# EasyEDA schematic Bras droit.json
TITLE: Arm Right; REV: 1.0; Date: 2020-07-07; Sheet: 1/1; Company: Your Company
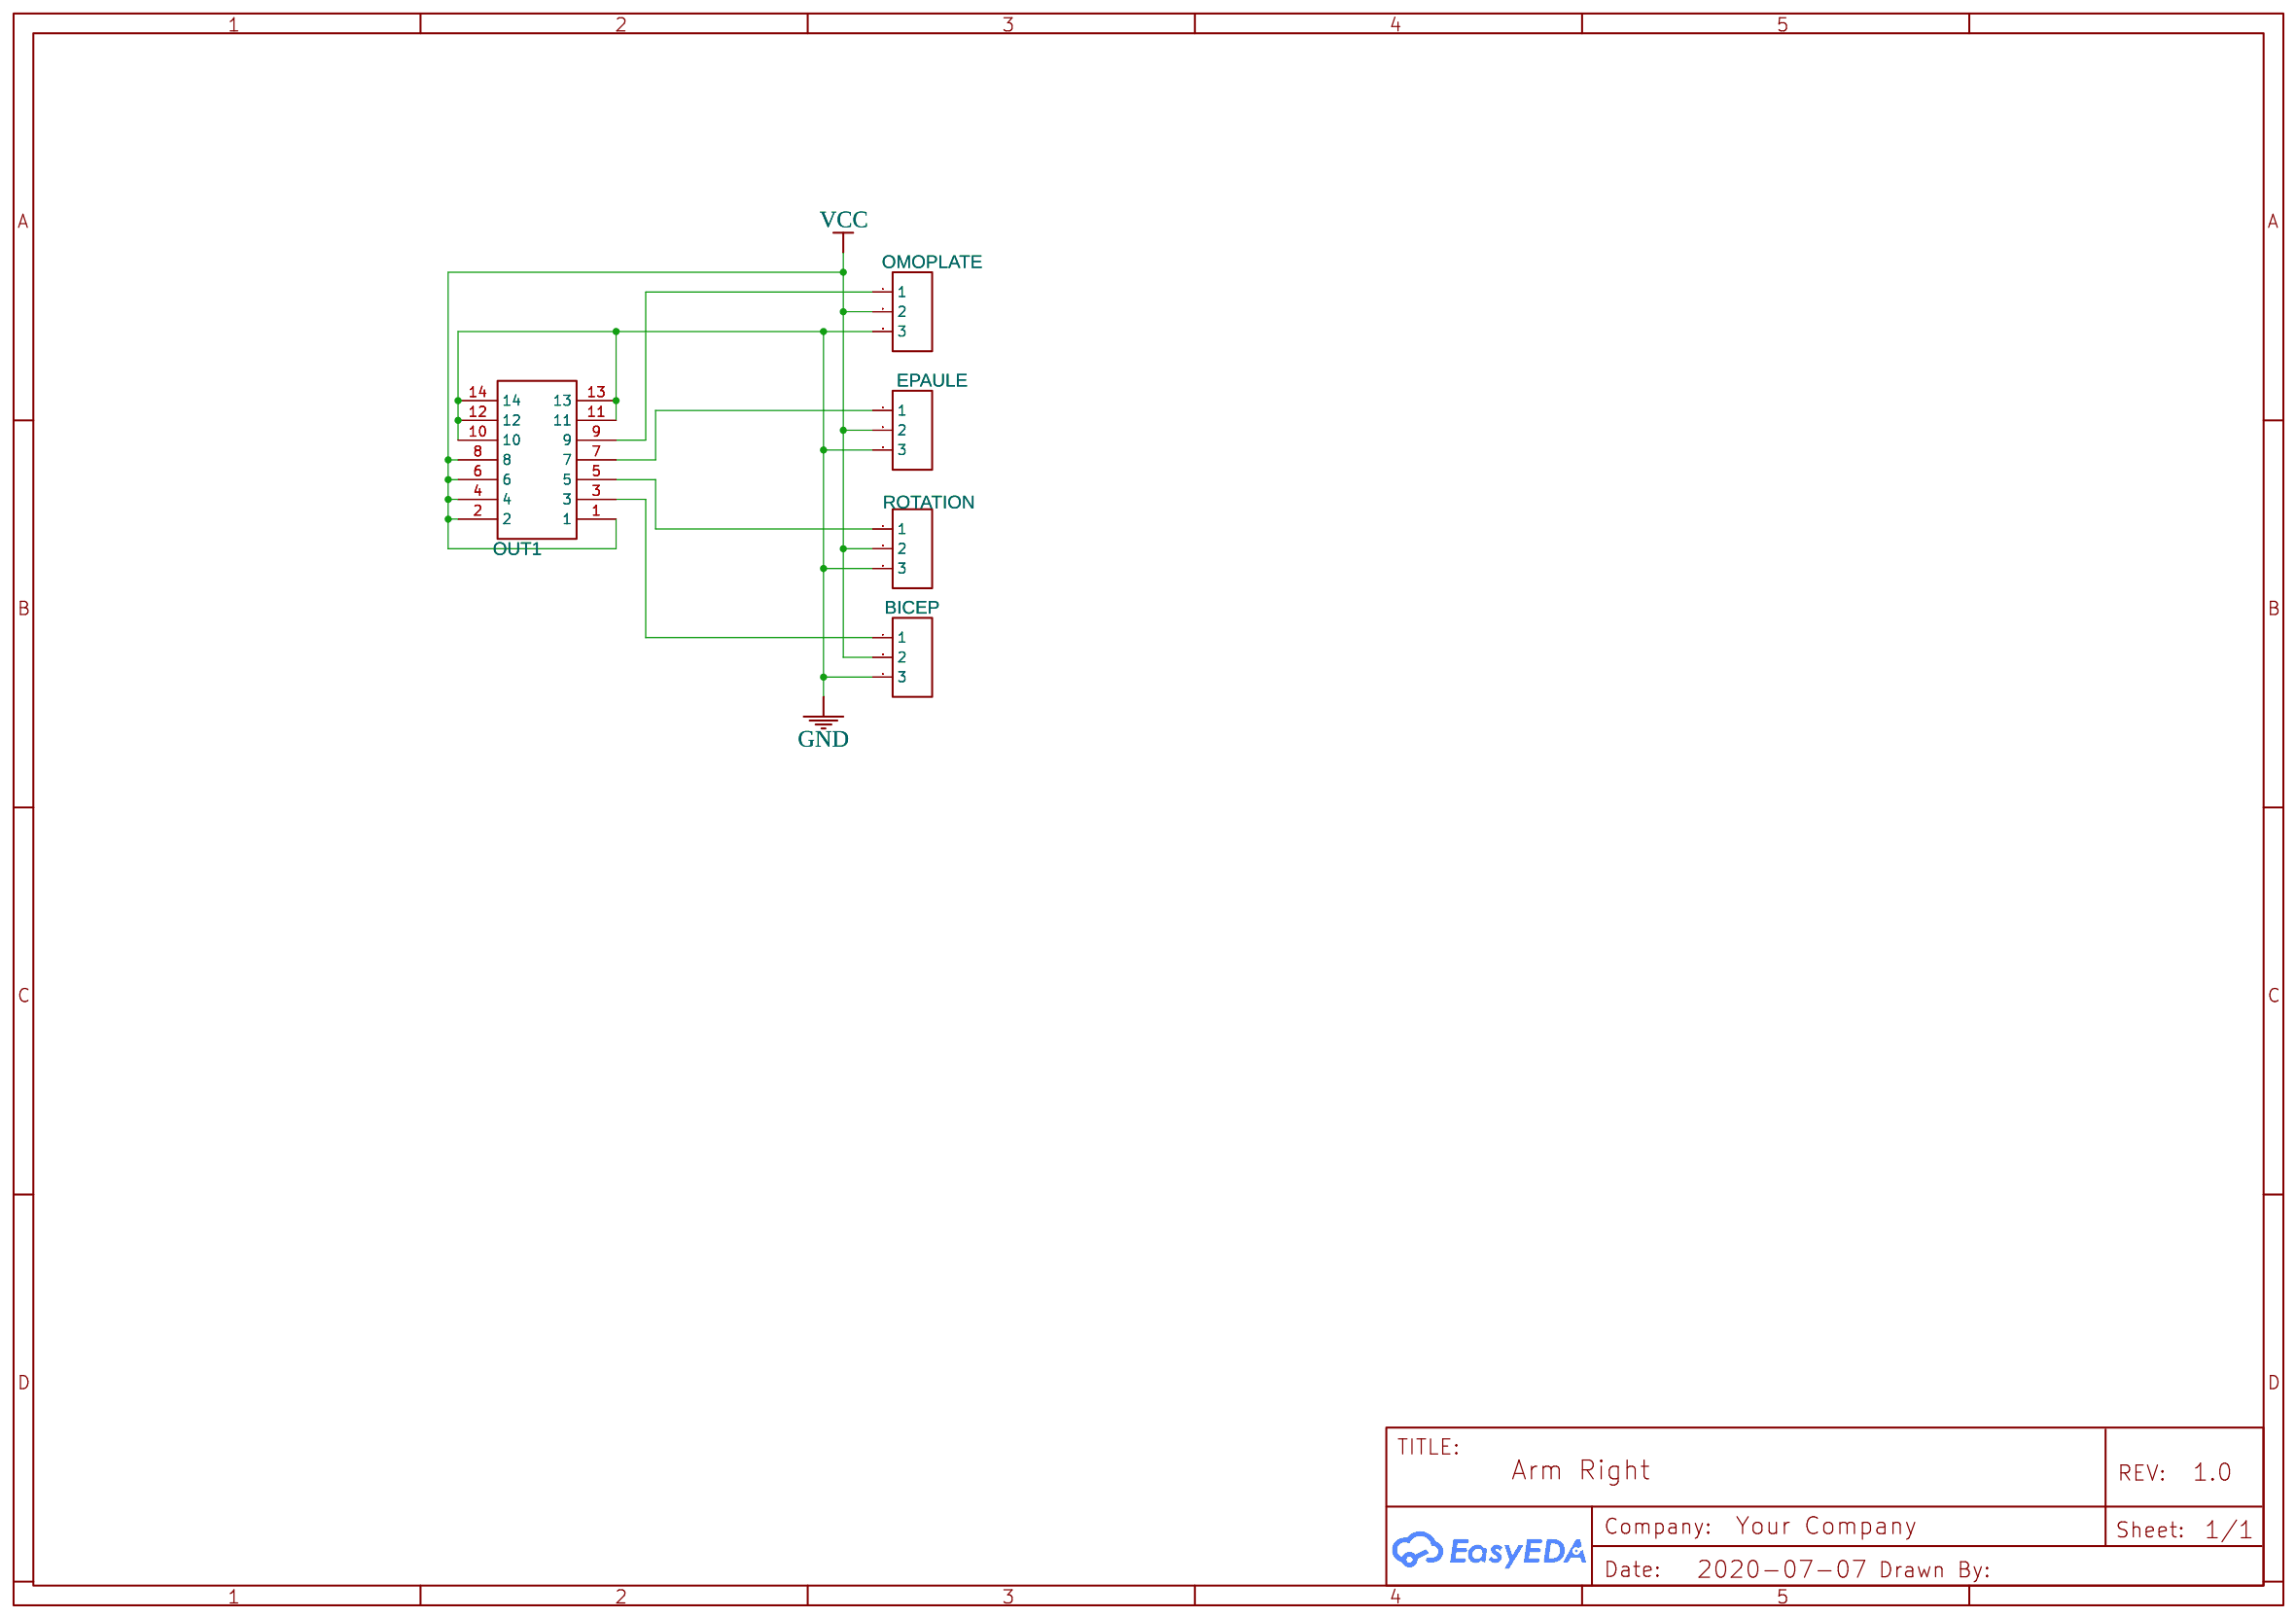
[diagram p0: schematic sheet]

## Parts
BICEP  1  [HDR-TH_3P-P2.54-V]
EPAULE  1  [HDR-TH_3P-P2.54-V]
OMOPLATE  1  [HDR-TH_3P-P2.54-V]
OUT1  Horn connector/2.0mm2*7P  [IDC-TH_14P-P2.00-V-M-R2-C7-S2.00]
ROTATION  1  [HDR-TH_3P-P2.54-V]

## Library data of the parts
BICEP EPAULE OMOPLATE ROTATION = Header-Male-2.54_1x3: Supplier: LCSC; Manufacturer: BOOMELE; Manufacturer Part: Header2.54mm 1*3P; image: //image.lceda.cn/szlcsc/C49257.jpg; Supplier Part: C49257
OUT1 = Horn connector/2.0mm2*7P: Supplier: LCSC; Manufacturer: BOOMELE; Manufacturer Part: Horn connector/2.0mm2*7P直简牛; Supplier Part: C29428

## Nets
GND: BICEP.3 EPAULE.3 OMOPLATE.3 OUT1.10 OUT1.11 OUT1.12 OUT1.13 OUT1.14 ROTATION.3
VCC: BICEP.2 EPAULE.2 OMOPLATE.2 OUT1.1 OUT1.2 OUT1.4 OUT1.6 OUT1.8 ROTATION.2
Net-(BICEP-1): BICEP.1 OUT1.3
Net-(EPAULE-1): EPAULE.1 OUT1.7
Net-(OMOPLATE-1): OMOPLATE.1 OUT1.9
Net-(OUT1-5): OUT1.5 ROTATION.1
